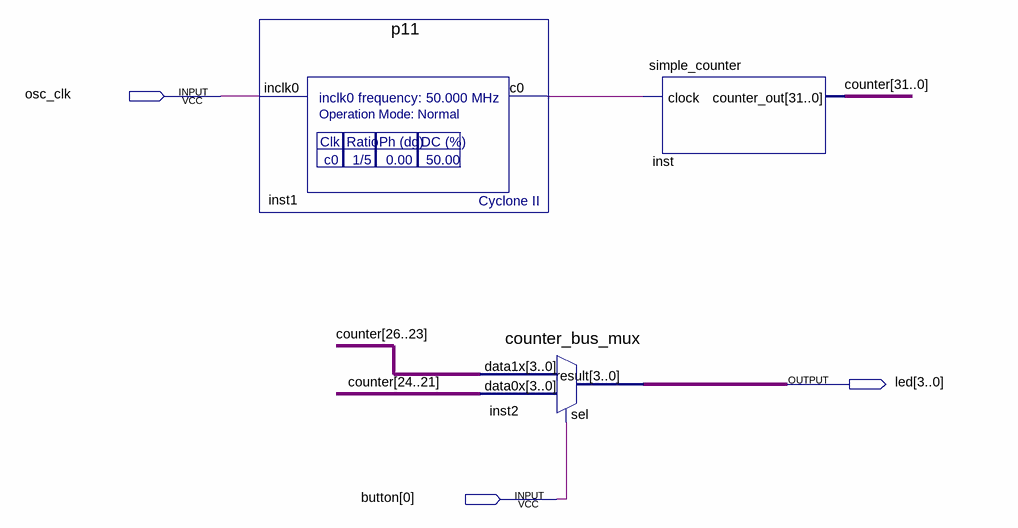
[diagram p0: schematic sheet]
// Quartus schematic phoenix_eye.bdf as structural Verilog: 3 symbols, 3 pins
module phoenix_eye (
  input  osc_clk,
  input  [0:0] button,
  output [3:0] led
);

  wire inst1_c0;
  wire [31:0] counter;

  p11 inst1 (.inclk0(osc_clk), .c0(inst1_c0));
  counter_bus_mux inst2 (.data1x(counter[26:23]), .data0x(counter[24:21]), .sel(button[0]), .result(led));
  simple_counter inst (.clock(inst1_c0), .counter_out(counter));
endmodule
